# EAGLE design linearSensor (EAGLE 6.5.0)
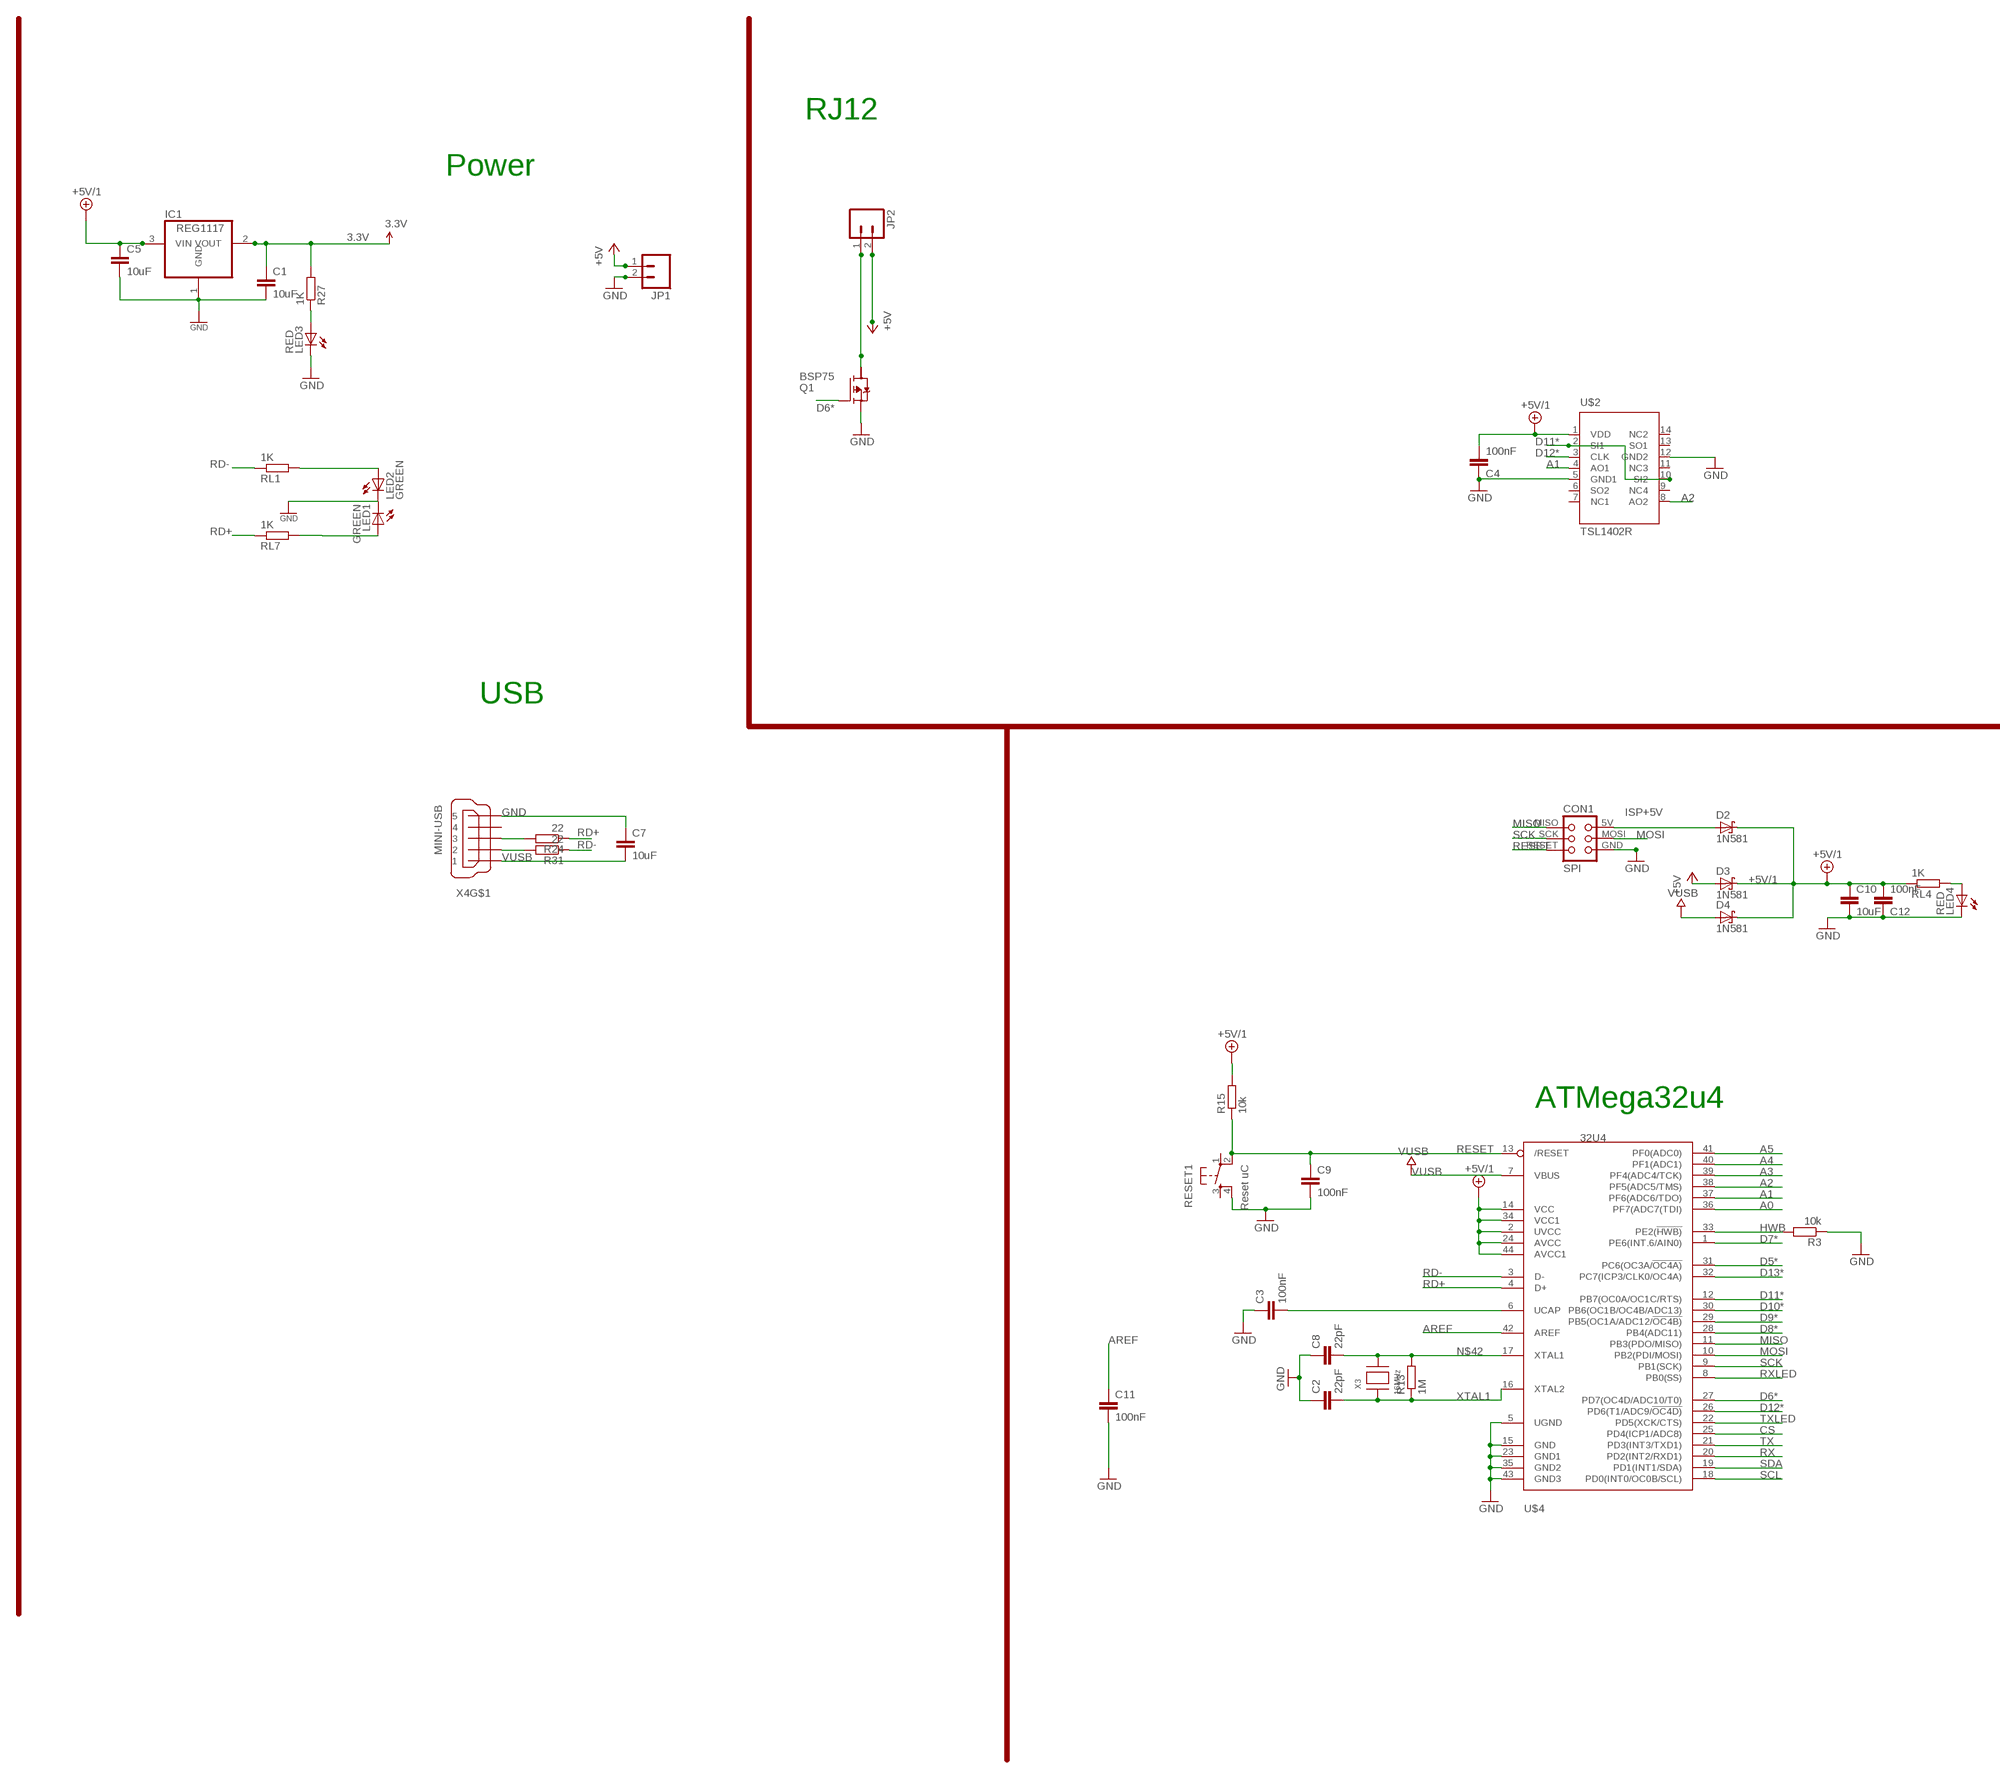
[diagram p0: schematic, sheet 1, part 1 of 2]
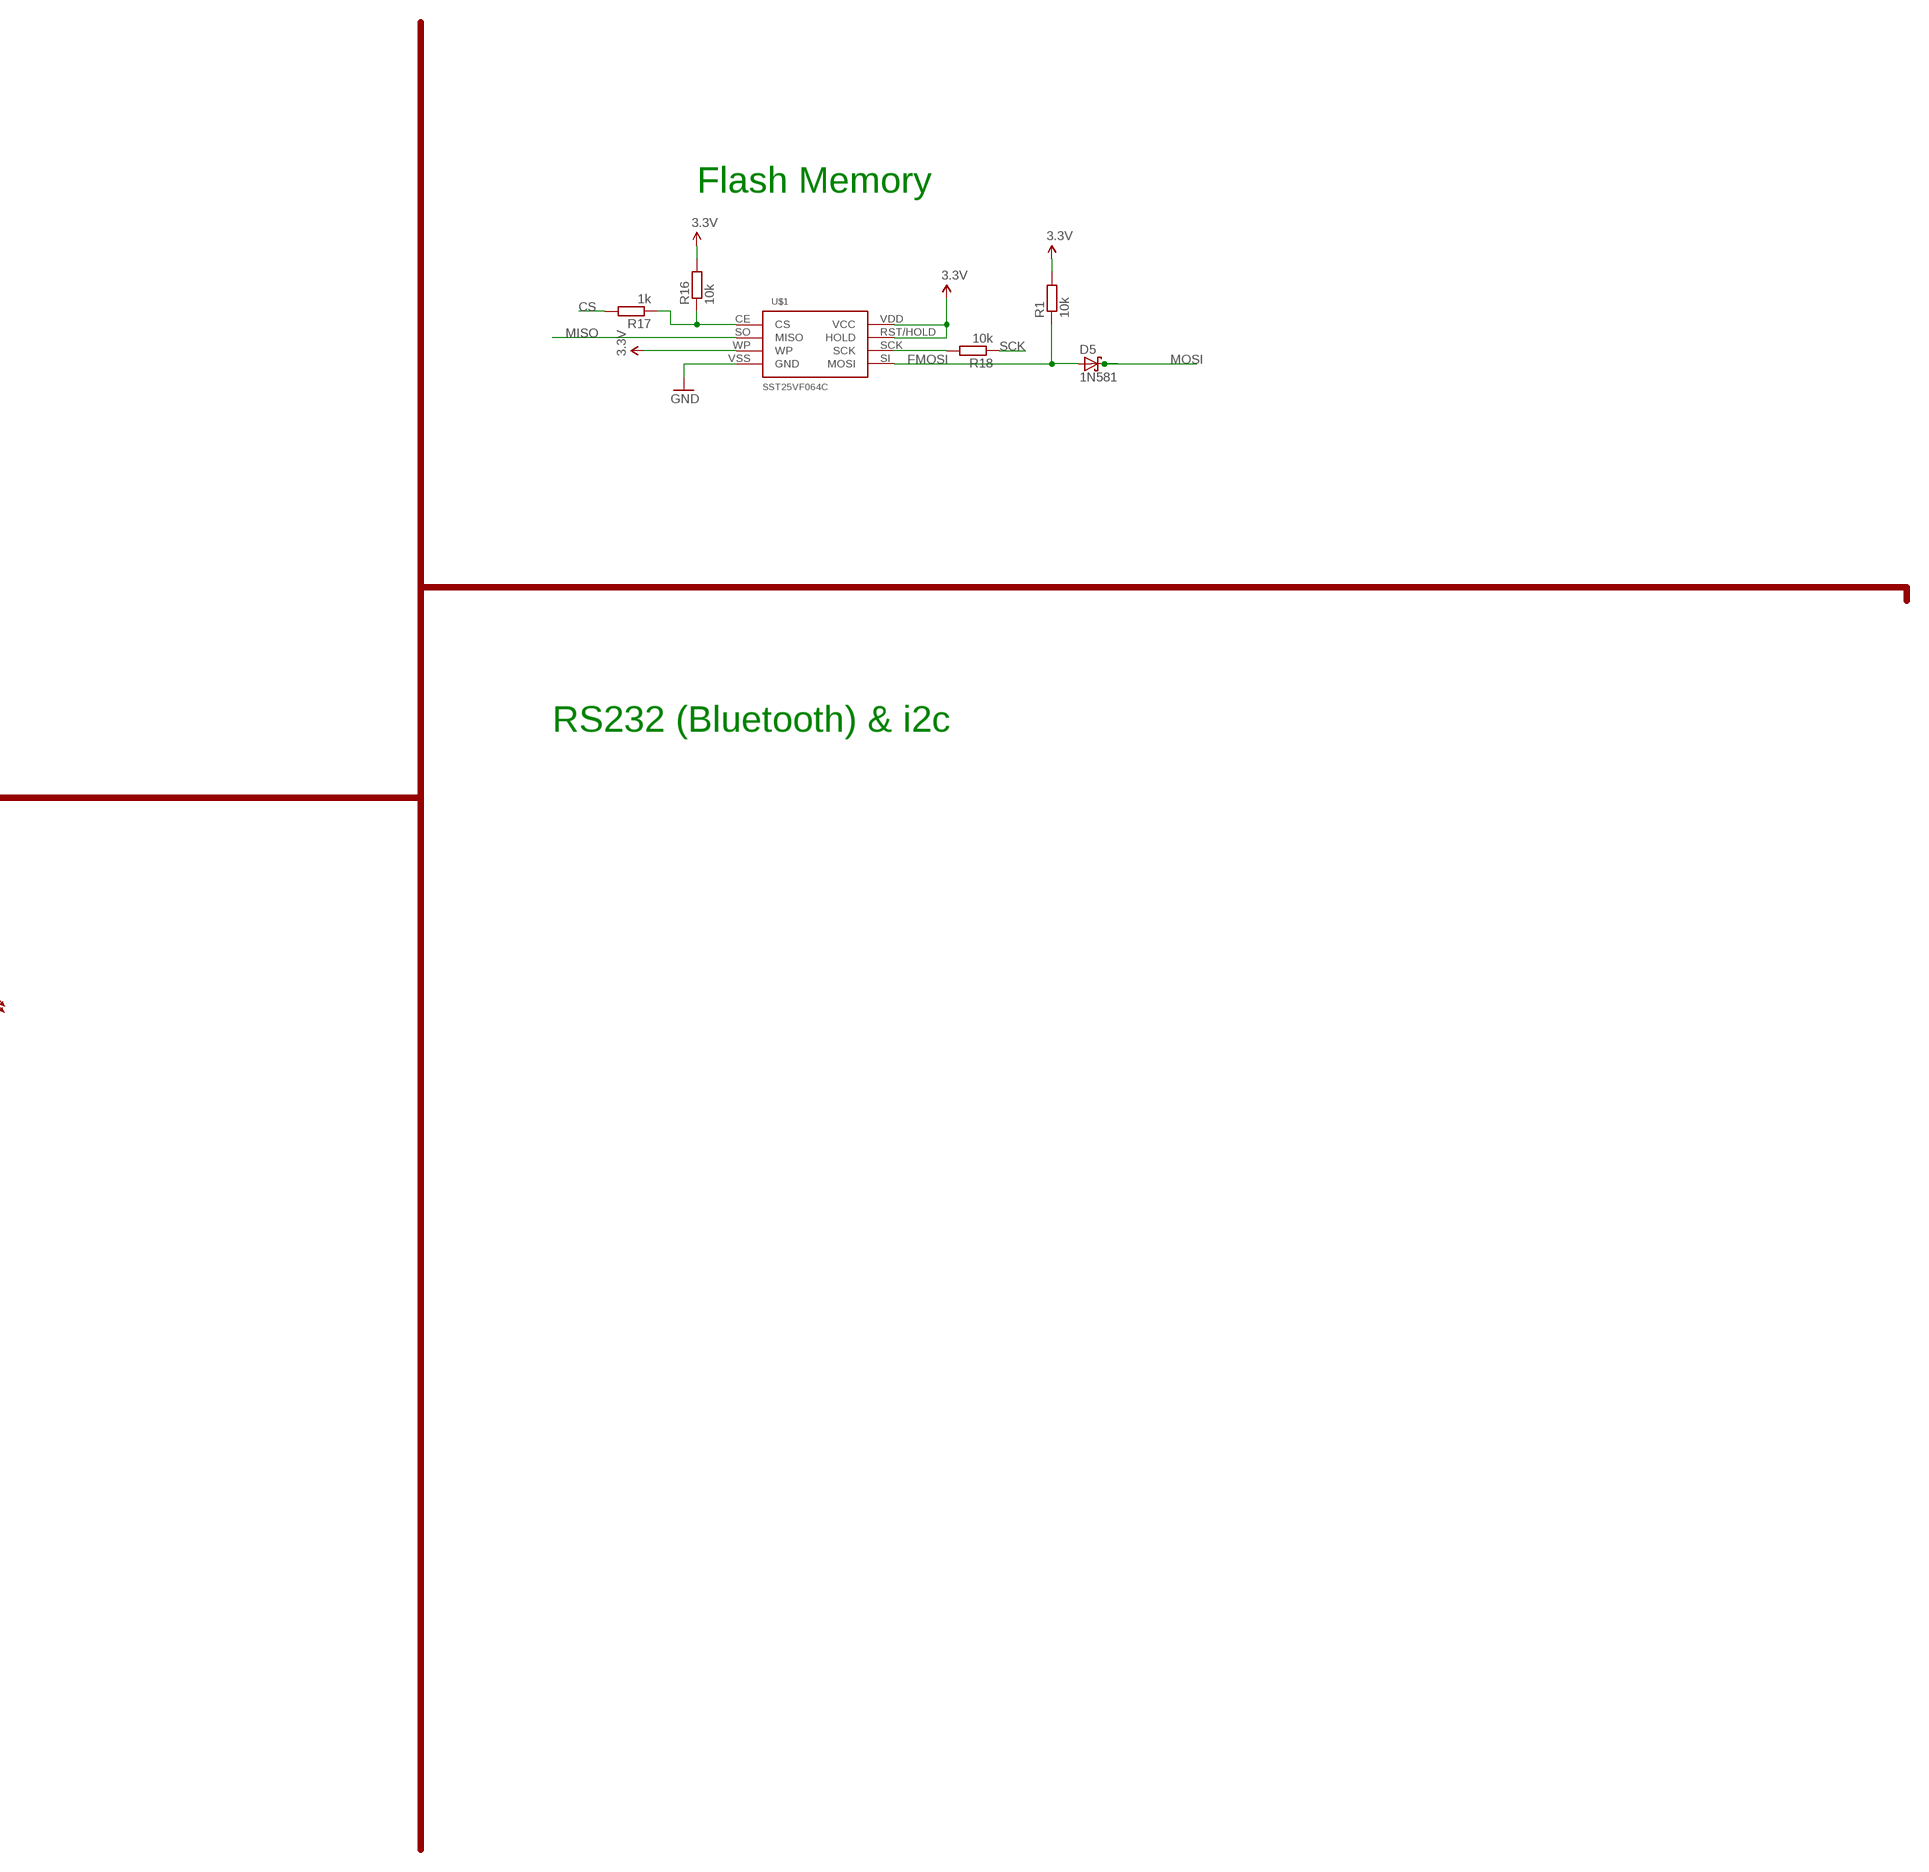
[diagram p1: schematic, sheet 1, part 2 of 2]

## Parts
C1  10uF  C-EUC1206  [C1206]
C2  22pF  C-EUC1206  [C1206]
C3  100nF  C-EUC1206  [C1206]
C4  100nF  C-EUC1206  [C1206]
C5  10uF  C-EUC1206  [C1206]
C7  10uF  C-EUC1206  [C1206]
C8  22pF  C-EUC1206  [C1206]
C9  100nF  C-EUC1206  [C1206]
C10  10uF  C-EUC1206  [C1206]
C11  100nF  C-EUC1206  [C1206]
C12  100nF  C-EUC1206  [C1206]
CON1  SPI  TINYISPT  [TC2030-MCP-NL]
D2  1N581  1N581D1206  [LED-1206]
D3  1N581  1N581D1206  [LED-1206]
D4  1N581  1N581D1206  [LED-1206]
D5  1N581  1N581D1206  [LED-1206]
IC1  REG1117  [SOT223]
JP1  M02LOCK_LONGPADS  [1X02_LOCK_LONGPADS]
JP2  M02LOCK_LONGPADS  [1X02_LOCK_LONGPADS]
LED1  GREEN  LEDCHIP-LED0805  [CHIP-LED0805]
LED2  GREEN  LEDCHIP-LED0805  [CHIP-LED0805]
LED3  RED  LEDCHIP-LED0805  [CHIP-LED0805]
LED4  RED  LEDCHIP-LED0805  [CHIP-LED0805]
Q1  BSP75  BSP613P  [PG-SOT-223]
R1  10k  R-EU_R1206  [R1206]
R3  10k  R-EU_M0805  [M0805]
R13  1M  R-EU_R1206  [R1206]
R15  10k  R-EU_M0805  [M0805]
R16  10k  R-EU_R1206  [R1206]
R17  1k  R-EU_R0805  [R0805]
R18  10k  R-EU_R1206  [R1206]
R24  22  R-EU_M1206  [M1206]
R27  1K  R-EU_R0805  [R0805]
R31  22  R-EU_M1206  [M1206]
RESET1  Reset uC  TAC_SWITCHSMD  [TACTILE_SWITCH_SMD]
RL1  1K  R-EU_R0805  [R0805]
RL4  1K  R-EU_R0805  [R0805]
RL7  1K  R-EU_R0805  [R0805]
U$1  SST25VF064C  [SOIC_8-LEAD]
U$2  TSL1402R  [DIL14]
U$4  32U4  ATMEGA32U4-AU  [TQFP44]
X3  16MHz  XTALNX6035  [NX6035]
X4  MINI-USB  MINI-USB-SCHIELD-32005-201  [32005-201]

## Nets
3.3V [power]: C1.1 IC1.2(VOUT) R1.2 R16.2 R27.2 U$1.RST/HOLD(HOLD) U$1.VDD(VCC) U$1.WP
+5V [power]: D3.A JP1.1 JP2.2
+5V/1 [fine]: C4.2 C5.1 C10.1 C12.2 D2.C D3.C D4.C IC1.3(VIN) R15.2 RL4.1 U$2.1(VDD) U$4.2(UVCC) U$4.14(VCC) U$4.24(AVCC) U$4.34(VCC1) U$4.44(AVCC1)
A0: U$4.36(PF7(ADC7(TDI))
A1: U$2.4(AO1) U$4.37(PF6(ADC6/TDO))
A2: U$2.8(AO2) U$4.38(PF5(ADC5/TMS))
A3: U$4.39(PF4(ADC4/TCK))
A4: U$4.40(PF1(ADC1))
A5: U$4.41(PF0(ADC0))
AREF: C11.1 U$4.42(AREF)
CS: R17.2 U$4.25(PD4(ICP1/ADC8))
D5*: U$4.31(PC6(OC3A/!OC4A))
D6*: Q1.1(G) U$4.27(PD7(OC4D/ADC10/T0))
D7*: U$4.1(PE6(INT.6/AIN0))
D8*: U$4.28(PB4(ADC11))
D9*: U$4.29(PB5(OC1A/ADC12/!OC4B))
D10*: U$4.30(PB6(OC1B/OC4B/ADC13))
D11*: U$2.2(SI1) U$2.10(SI2) U$4.12(PB7(OC0A/OC1C/RTS))
D12*: U$2.3(CLK) U$4.26(PD6(T1/ADC9/!OC4D))
D13*: U$4.32(PC7(ICP3/CLK0/OC4A))
D+USB: R24.2 X4.3
D-USB: R31.2 X4.2
FMOSI: D5.A R1.1 U$1.SI(MOSI)
GND [power]: C1.2 C2.1 C3.1 C4.1 C5.2 C7.1 C8.1 C9.2 C10.2 C11.2 C12.1 CON1.GND IC1.1(GND) JP1.2 LED1.C LED2.C LED3.C LED4.C Q1.3(S) R3.1 RESET1.4 U$1.VSS(GND) U$2.5(GND1) U$2.12(GND2) U$4.5(UGND) U$4.15(GND) U$4.23(GND1) U$4.35(GND2) U$4.43(GND3) X4.5
HWB: R3.2 U$4.33(PE2(!HWB))
ISP+5V: CON1.5V(VCC) D2.A
MISO: CON1.MISO U$1.SO(MISO) U$4.11(PB3(PDO/MISO))
MOSI: CON1.MOSI D5.C U$4.10(PB2(PDI/MOSI))
N$8: LED2.A RL1.2
N$10: R16.1 R17.1 U$1.CE(CS)
N$12: LED4.A RL4.2
N$14: LED1.A RL7.2
N$16: C3.2 U$4.6(UCAP)
N$20: LED3.A R27.1
N$23: R18.2 U$1.SCK
N$34: JP2.1 Q1.2(D)
N$42: C8.2 R13.2 U$4.17(XTAL1) X3.P$2
RD+: R24.1 RL7.1 U$4.4(D+)
RD-: R31.1 RL1.1 U$4.3(D-)
RESET: C9.1 CON1.RESET R15.1 RESET1.2 U$4.13(/RESET)
RX: U$4.20(PD2(INT2/RXD1))
RXLED: U$4.8(PB0(SS))
SCK: CON1.SCK R18.1 U$4.9(PB1(SCK))
SCL: U$4.18(PD0(INT0/OC0B/SCL))
SDA: U$4.19(PD1(INT1/SDA))
TX: U$4.21(PD3(INT3/TXD1))
TXLED: U$4.22(PD5(XCK/CTS))
VUSB: C7.2 D4.A U$4.7(VBUS) X4.1
XTAL1: C2.2 R13.1 U$4.16(XTAL2) X3.P$1
Unconnected: Q1.4(D) RESET1.1 RESET1.3 U$2.6(SO2) U$2.7(NC1) U$2.9(NC4) U$2.11(NC3) U$2.13(SO1) U$2.14(NC2) X4.4 X4.M1(S:S1) X4.M2(S:S2) X4.M3(S:S3) X4.M4(S:S4)

## Notes on the sheet
- RJ12
- Power
- Flash Memory
- RS232 (Bluetooth) & i2c
- USB
- ATMega32u4

## Library data of the parts
C1-C5 C7-C12 = rcl:C-EU: CAPACITOR, European symbol
CON1 = lpatiny:TINYISP: CONNECTOR
D2-D5 = lpatiny:1N581*: 1.0A SCHOTTKY BARRIER RECTIFIER Source: http://www.diodes.com/datasheets/ds23001.pdf
IC1 = burr-brown:REG1117: 800mA and 1A Low Dropout (LDO) Positive Regulator 1.8V, 2.5V, 2.85V, 3.3V, 5V, and Adj; MPN: REG1117; OC_FARNELL: 1097566; OC_NEWARK: 14P6981
JP1 JP2 = SparkFun:M02: Header 2 Standard 2-pin 0.1" header. Use with straight break away headers (SKU : PRT-00116), right angle break away headers (PRT-00553), swiss pins (PRT-00743), machine pins (PRT-00117), and female headers (PRT-00115). Molex polarized connector foot print use with SKU : PRT-08233 with associated crimp pins and housings.
LED1-LED4 = led:LED: LED OSRAM: - CHIPLED LG R971, LG N971, LY N971, LG Q971, LY Q971, LO R971, LY R971 LH N974, LH R974 LS Q976, LO Q976, LY Q976 LO Q996 - Hyper CHIPLED LW Q18S LB Q993, LB Q99A, LB R99A - SideLED LS A670, LO A670, LY A670, LG A670, LP A670 LB A673, LV A673, LT A673, LW A673 LH A674 LY A675 LS A676, LA A676, LO A676, LY A676, LW A676 LS A679, LY A679, LG A679 - Hyper Micro SIDELED® LS Y876, LA Y876, LO Y876, LY Y876 LT Y87S - SmartLED LW L88C, LW L88S LB L89C, LB L89S, LG L890 LS L89K, LO L89K, LY L89K LS L896, LA L896, LO L896, LY L896 - TOPLED LS T670, LO T670, LY T670, LG T670, LP T670 LSG T670, LSP T670, LSY T670, LOP T670, LYG T670 LG T671, LOG T671, LSG T671 LB T673, LV T673, LT T673, LW T673 LH T674 LS T676, LA T676, LO T676, LY T676, LB T676, LH T676, LSB T676, LW T676 LB T67C, LV T67C, LT T67C, LS T67K, LO T67K, LY T67K, LW E67C LS E67B, LA E67B, LO E67B, LY E67B, LB E67C, LV E67C, LT E67C LW T67C LS T679, LY T679, LG T679 LS T770, LO T770, LY T770, LG T770, LP T770 LB T773, LV T773, LT T773, LW T773 LH T774 LS E675, LA E675, LY E675, LS T675 LS T776, LA T776, LO T776, LY T776, LB T776 LHGB T686 LT T68C, LB T68C - Hyper Mini TOPLED® LB M676 - Mini TOPLED Santana® LG M470 LS M47K, LO M47K, LY M47K Source: http://www.osram.convergy.de LUXEON: - LUMILED® LXK2-PW12-R00, LXK2-PW12-S00, LXK2-PW14-U00, LXK2-PW14-V00 LXK2-PM12-R00, LXK2-PM12-S00, LXK2-PM14-U00 LXK2-PE12-Q00, LXK2-PE12-R00, LXK2-PE12-S00, LXK2-PE14-T00, LXK2-PE14-U00 LXK2-PB12-K00, LXK2-PB12-L00, LXK2-PB12-M00, LXK2-PB14-N00, LXK2-PB14-P00, LXK2-PB14-Q00 LXK2-PR12-L00, LXK2-PR12-M00, LXK2-PR14-Q00, LXK2-PR14-R00 LXK2-PD12-Q00, LXK2-PD12-R00, LXK2-PD12-S00 LXK2-PH12-R00, LXK2-PH12-S00 LXK2-PL12-P00, LXK2-PL12-Q00, LXK2-PL12-R00 Source: www.luxeon.com KINGBRIGHT: KA-3528ASYC Source: www.kingbright.com
Q1 = infineon:BSP613P: SIPMOS (R) Small-Signal-Transistor P-Channel (2 Drain) Source: http://www.infineon.com/dgdl/BSP613P_Rev2.4.pdf; OC_FARNELL: unknown; OC_NEWARK: unknown
R1 R13 R16-R18 R27 RL1 RL7 = rcl:R-EU_: RESISTOR, European symbol
R3 R15 R24 R31 RL4 = resistor:R-EU_: RESISTOR, European symbol
RESET1 = lpatiny:TAC_SWITCH: Momentary Switch Button commonly used for reset or general input. Spark Fun Electronics SKU : COM-00097
U$1 = BertaLib:SST25VF064C
U$2 = lpatiny:TSL1402R
U$4 = adafruit:ATMEGA32U4: http://www.ladyada.net/library/eagle
X3 = lpatiny:XTAL: Low cost SMT crystals, no capacitors included http://www.ladyada.net/library/eagle
X4 = con-cypressindustries:MINI-USB-SCHIELD-: MINI USB-B Conector Source: www.cypressindustries.com; OC_FARNELL: unknown; OC_NEWARK: unknown

## Net classes
0 default: width 0.305 mm
1 power: width 0.457 mm
2 VIN: width 0.457 mm
3 fine: width 0.305 mm
4 aref: width 0.305 mm

## Board
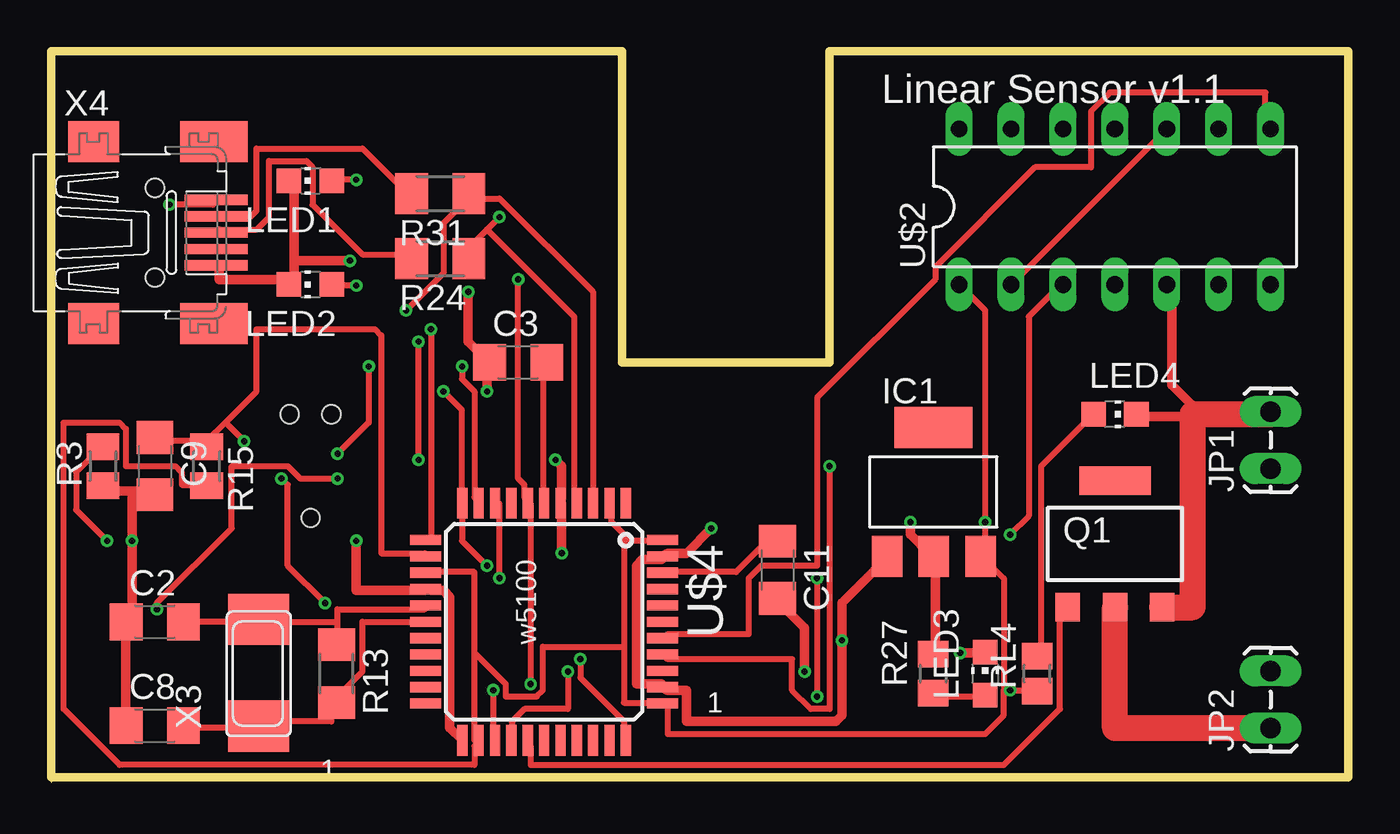
[diagram p2: board, top side]
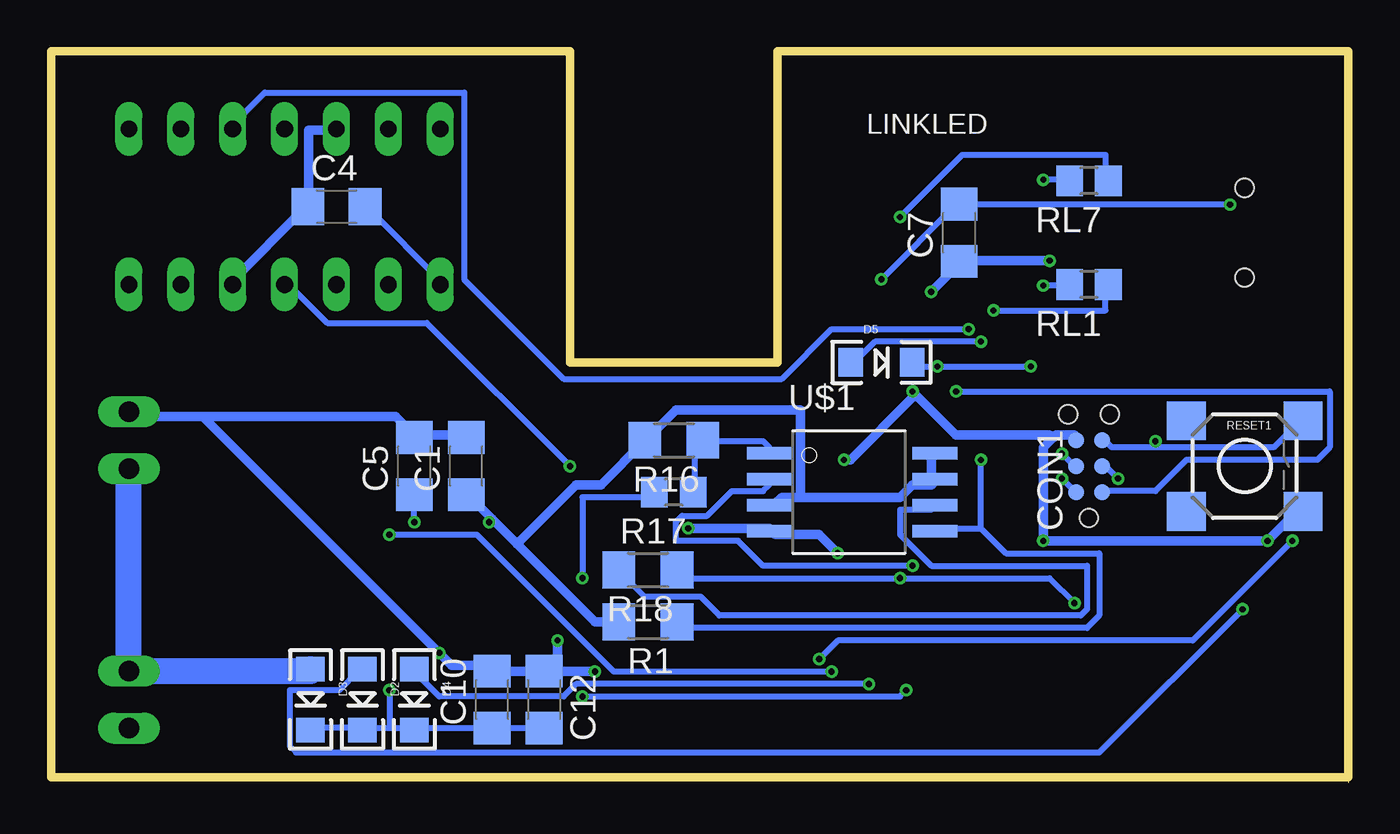
[diagram p3: board, bottom side, seen from below]

Size 63.5 x 35.81 mm. Coordinates in mm from the lower left corner, seen from the top.
Outline: 0,35.81 0,0.25
Outline: 0,0.25 0,0
Outline: 0,35.81 27.94,35.81 27.94,20.57 38.1,20.57 38.1,35.81 63.5,35.81 63.5,0.25 0,0.25
Outline: 0,35.81 0,0.25
Copper layers (1*16): Top 0.035mm / dielectric 1.5mm / Bottom 0.035mm
Design rules "Fusion_eagle_rule_v1.1": minimum track width 6mil, minimum drill 12mil, track to track 6mil, track to pad 6mil, pad to pad 6mil, via to via 6mil, smd to smd 0mil, copper to edge 10mil, drill to drill 10mil, minimum pad ring 10mil, minimum via ring 6mil, stop-mask expansion 2mil, vias tented up to drill 100mil, thermal gap 10mil
vRestrict: area 16.5,0.3 to 31.8,4.1; area 16.5,1.5 to 20.3,15.5; area 27.9,2.8 to 31.8,15.5; area 16.5,11.7 to 31.8,15.5

### Footprints (pad centres in the part's own frame; a part is rotated, then mirrored left to right if it is on the bottom)
C1206 = smd 1.6 x 1.8: 1 -1.4,0; 2 1.4,0
TC2030-MCP-NL = smd 0.787 x 0.787: 5V 1.27,0.635; GND 3.81,0.635; MISO 1.27,-0.635; MOSI 2.54,0.635; RESET 3.81,-0.635; SCK 2.54,-0.635 | hole 0.889: 0,0; 5.08,-1.016; 5.08,1.016
LED-1206 = smd 1.2 x 1.4: A -1.5,0; C 1.5,0
SOT223 = smd 1.499 x 2.007: 1 -2.261,-3.15; 2 0.025,-3.15; 3 2.311,-3.15 | smd 3.81 x 2.007: 4 0,3.15
1X02_LOCK_LONGPADS = drill 1.016 long: 1 -0.127,0; 2 2.667,0
CHIP-LED0805 = smd 1.2 x 1.2: A 0,-1.05; C 0,1.05
PG-SOT-223 = smd 1.2 x 1.4: 1 -2.311,-3.099; 2 0,-3.099; 3 2.311,-3.099 | smd 3.5 x 1.4: 4 0,3.099
R1206 = smd 1.6 x 1.803: 1 -1.422,0; 2 1.422,0
M0805 = smd 1.3 x 1.6: 1 -0.95,0; 2 0.95,0
R0805 = smd 1.3 x 1.5: 1 -0.95,0; 2 0.95,0
M1206 = smd 1.6 x 2: 1 -1.4,0; 2 1.4,0
TACTILE_SWITCH_SMD = smd 1.905 x 1.905: 1 -2.857,2.223; 2 2.857,2.223; 3 -2.857,-2.223; 4 2.857,-2.223
R0805' = smd 1.3 x 1.5: 1 -0.85,0; 2 0.85,0
SOIC_8-LEAD = smd 0.61 x 2.21: CE -1.905,-2.934; RST/HOLD -0.635,5.156; SCK 0.635,5.156; SI 1.905,5.156; SO -0.635,-2.934; VDD -1.905,5.156; VSS 1.905,-2.934; WP 0.635,-2.934
DIL14 = drill 0.813 long: 1 -7.62,-3.81; 2 -5.08,-3.81; 3 -2.54,-3.81; 4 0,-3.81; 5 2.54,-3.81; 6 5.08,-3.81; 7 7.62,-3.81; 8 7.62,3.81; 9 5.08,3.81; 10 2.54,3.81; 11 0,3.81; 12 -2.54,3.81; 13 -5.08,3.81; 14 -7.62,3.81
TQFP44 = smd 1.5 x 0.5: 1 -5.8,4; 2 -5.8,3.2; 3 -5.8,2.4; 4 -5.8,1.6; 5 -5.8,0.8; 6 -5.8,0; 7 -5.8,-0.8; 8 -5.8,-1.6; 9 -5.8,-2.4; 10 -5.8,-3.2; 11 -5.8,-4; 23 5.8,-4; 24 5.8,-3.2; 25 5.8,-2.4; 26 5.8,-1.6; 27 5.8,-0.8; 28 5.8,0; 29 5.8,0.8; 30 5.8,1.6; 31 5.8,2.4; 32 5.8,3.2; 33 5.8,4 | smd 0.5 x 1.5: 12 -4,-5.8; 13 -3.2,-5.8; 14 -2.4,-5.8; 15 -1.6,-5.8; 16 -0.8,-5.8; 17 0,-5.8; 18 0.8,-5.8; 19 1.6,-5.8; 20 2.4,-5.8; 21 3.2,-5.8; 22 4,-5.8; 34 4,5.8; 35 3.2,5.8; 36 2.4,5.8; 37 1.6,5.8; 38 0.8,5.8; 39 0,5.8; 40 -0.8,5.8; 41 -1.6,5.8; 42 -2.4,5.8; 43 -3.2,5.8; 44 -4,5.8
NX6035 = smd 2.5 x 3: P$1 2.665,0; P$2 -2.565,0
32005-201 = smd 3.1 x 0.5: 1 3,1.6; 2 3,0.8; 3 3,0; 4 3,-0.8; 5 3,-1.6 | smd 2.5 x 2: M1 -3,-4.45; M2 -3,4.45 | smd 3.3 x 2: M3 2.9,4.45; M4 2.9,-4.45 | hole 0.9: 0,2.2; 0,-2.2

### Placement (x,y rotation side)
C1  43.18,15.49 90 bottom
C2  5.08,7.87 0 top
C3  22.86,20.57 0 top
C4  49.53,28.19 0 bottom
C5  45.72,15.49 90 bottom
C7  19.05,26.92 90 bottom
C8  5.08,2.79 0 top
C9  5.08,15.49 270 top
C10  41.91,4.06 90 bottom
C11  35.56,10.41 270 top
C12  39.37,4.06 270 bottom
CON1  12.7,12.95 90 bottom
D2  48.26,4.06 270 bottom
D3  50.8,4.06 270 bottom
D4  45.72,4.06 270 bottom
D5  22.86,20.57 0 bottom
IC1  43.18,14.22 0 top
JP1  59.69,15.49 90 top
JP2  59.69,2.79 90 top
LED1  12.7,29.46 90 top
LED2  12.7,24.38 90 top
LED3  45.72,5.33 0 top
LED4  52.07,18.03 270 top
Q1  52.07,11.68 0 top
R1  34.29,7.87 180 bottom
R3  2.54,15.49 90 top
R13  13.97,5.33 270 top
R15  7.62,15.49 270 top
R16  33.02,16.76 180 bottom
R17  33.02,14.22 180 bottom
R18  34.29,10.41 180 bottom
R24  19.05,25.65 180 top
R27  43.18,5.33 90 top
R31  19.05,28.83 180 top
RESET1  5.08,15.49 0 bottom
RL1  12.7,24.38 180 bottom
RL4  1K  [R0805']  48.26,5.33 90 top
RL7  12.7,29.46 180 bottom
U$1  25.4,14.22 270 bottom
U$2  52.07,28.19 0 top
U$4  24.13,7.87 270 top
X3  10.16,5.33 90 top
X4  5.08,26.92 0 top

### Tracks (layer width: path | path; a pad name or v marks a point on that pad's centre or on a via)
3.3V  (via drill 0.3)
  Top 0.457: R27.2 43.28,6.35 43.28,10.92 IC1.2 42.98,11.23 42.06,12.14 v42.06,12.75
  Bottom 0.457: U$1.VDD 20.42,16.1 20.42,14.88 U$1.RST/HOLD 20.42,14.58 21.34,14.58 21.95,13.97 26.82,13.97 | 26.82,13.97 27.74,13.97 28.04,13.66 U$1.WP | 40.69,11.68 36.88,7.87 35.97,7.87 R1.2 | 40.69,11.68 41.91,12.9 | 41.91,12.9 42.98,13.97 C1.1 | 40.69,11.68 40.54,11.84 37.8,14.58 36.58,14.58 34.44,16.71 R16.2 34.14,17.02 32.92,18.24 26.82,18.24 26.82,13.97 | v42.06,12.75 41.91,12.9
+5V
  Bottom 1.27: JP1.1 JP2.2 50.8,5.46 D3.A
+5V/1  (via drill 0.3)
  Top 0.305: 46.63,4.52 v46.94,4.52 48.16,4.52 RL4.1 | 46.63,4.52 46.63,10.01 45.72,10.92 IC1.3 45.72,11.23 v45.72,12.75 45.72,23.11 44.5,24.33 U$2.1 | 28.04,12.14 28.35,11.84 29.87,11.84 U$4.44 | 28.04,12.14 27.43,12.75 27.43,13.66 U$4.2 | 28.04,12.14 28.04,6.65 | 28.04,6.65 28.04,3.91 29.87,3.91 U$4.34 30.18,3.91 30.18,2.39 45.72,2.39 46.63,3.3 46.63,4.52 | 20.73,6.35 20.73,2.08 U$4.24 20.73,1.78 20.73,0.86 3.35,0.86 0.61,3.61 0.61,17.63 3.35,17.63 3.66,17.32 3.66,15.49 6.1,15.49 6.4,15.19 6.4,14.58 7.62,14.58 R15.2 | 20.73,6.35 20.73,10.31 18.59,10.31 U$4.14 | 28.04,6.65 24.08,6.65 24.08,4.52 23.77,4.22 22.25,4.22 22.25,4.83 20.73,6.35
  Bottom 0.305: C12.2 39.62,2.69 41.76,2.69 C10.1 42.06,2.69 45.72,2.69 | 46.94,2.69 48.16,2.69 D2.C 48.46,2.69 50.6,2.69 D3.C | 46.94,2.69 45.72,2.69 | 45.72,2.69 D4.C 45.72,2.69 | C4.2 47.85,27.99 44.5,24.64 U$2.1 | v45.72,12.75 45.72,13.97 C5.1 | v46.94,4.52 46.94,2.69
A1  (via drill 0.3)
  Top 0.305: v38.1,15.49 38.1,3.61 37.19,3.61 36.27,4.52 36.27,6.04 30.18,6.04 U$4.37
  Bottom 0.305: v38.1,15.49 45.11,22.5 49.99,22.5 51.82,24.33 U$2.4
A2
  Top 0.305: U$4.38 30.18,7.26 34.14,7.26 34.14,10.01 34.75,10.62 37.49,10.62 37.49,18.85 43.28,24.64 43.28,25.25 48.16,30.12 50.9,30.12 50.9,32.87 51.82,33.78 59.44,33.78 59.44,32.26 U$2.8
AREF
  Top 0.305: U$4.42 30.18,10.31 33.53,10.31 34.75,11.53 35.36,11.53 C11.1
CS  (via drill 0.3)
  Top 0.305: v21.64,4.52 21.64,2.08 U$4.25 | v37.49,10.01 v37.49,4.22
  Bottom 0.305: v21.64,4.52 21.95,4.22 v37.49,4.22 | v37.49,10.01 37.49,13.97 34.14,13.97 R17.2
D6*
  Top 0.305: Q1.1 49.68,8.48 49.38,8.18 49.38,3.61 46.63,0.86 23.47,0.86 23.47,1.78 U$4.27
D11*  (via drill 0.3)
  Top 0.305: v18.59,22.2 18.59,11.84 U$4.12 | U$2.2 47.24,24.64 54.56,31.95 U$2.10
  Bottom 0.305: v18.59,22.2 25.3,22.2 27.74,19.76 38.41,19.76 43.28,24.64 43.28,33.78 53.03,33.78 54.56,32.26 U$2.10
D12*  (via drill 0.3)
  Top 0.305: v25.3,5.44 25.3,3.61 23.16,3.61 22.55,3 22.55,2.08 U$4.26 | v46.94,12.14 47.85,13.06 47.85,22.81 49.38,24.33 U$2.3
  Bottom 0.305: v25.3,5.44 35.97,5.44 42.67,12.14 v46.94,12.14
D+USB
  Top 0.305: R24.2 17.37,25.86 15.24,25.86 12.8,28.3 12.8,30.12 12.5,30.43 10.67,30.43 10.67,27.69 10.06,27.08 8.23,27.08 X4.3
D-USB
  Top 0.305: R31.2 17.37,28.91 15.24,31.04 10.06,31.04 10.06,27.99 9.75,27.69 8.23,27.69 X4.2
FMOSI  (via drill 0.3)
  Top 0.305: v17.98,15.8 v17.98,21.59
  Bottom 0.305: v17.98,21.59 23.16,21.59 24.08,20.68 D5.A | 17.98,12.45 v17.98,15.8 | 17.98,12.45 20.12,12.45 U$1.SI | 17.98,12.45 16.76,11.23 12.19,11.23 12.19,8.18 12.8,7.57 32.31,7.57 32.61,7.87 R1.1
GND  (via drill 0.3)
  Top 0.457: v20.42,24.03 20.42,21.59 21.34,20.68 C3.1 21.34,20.37 v21.34,19.15 | X4.5 8.23,25.25 8.23,24.64 11.58,24.64 LED2.C 11.89,24.64 11.89,25.55 | 11.89,25.55 11.89,29.21 LED1.C | 11.89,25.55 v14.63,25.55 | 3.96,14.28 4.88,14.28 C9.2 | 3.96,14.28 2.74,14.28 R3.1 | C8.1 3.66,3 3.66,7.87 C2.1 3.96,7.87 v3.96,11.84 3.96,14.28 | U$4.23 20.12,2.08 19.51,2.69 19.51,9.09 19.2,9.4 18.59,9.4 U$4.15 18.29,9.4 14.94,9.4 v14.94,11.84 | v24.99,11.23 24.99,13.66 U$4.5 24.99,13.97 24.99,15.49 v24.69,15.8 | IC1.1 40.84,11.23 IC1.1 | IC1.1 40.84,10.92 38.71,8.79 v38.71,6.96 38.71,3.3 38.41,3 31.09,3 31.09,4.52 30.18,4.52 U$4.35 29.87,4.83 28.65,4.83 28.65,10.62 28.96,10.92 29.87,10.92 U$4.43 30.18,11.23 31.09,11.23 v32.31,12.45 | v44.5,6.35 45.72,6.35 LED3.C | v36.88,5.44 36.88,7.57 35.66,8.79 C11.2 | LED4.C 53.34,17.93 55.47,17.93 55.88,17.93 | 55.88,18.03 55.78,18.54 54.86,19.46 54.86,24.33 U$2.5
  Top 1.27: Q1.3 55.88,8.58 55.88,17.93 55.88,18.03 59.69,18.03 JP1.2
  Bottom 0.457: v20.42,24.03 19.2,25.25 C7.1 18.9,25.55 v14.63,25.55 | 14.48,16.87 14.94,16.41 v14.94,11.84 v3.96,11.84 2.74,13.06 2.44,13.06 RESET1.4 | 14.48,16.87 14.33,17.02 13.41,17.02 CON1.GND | 21.18,19 19.2,17.02 14.63,17.02 14.48,16.87 | 21.18,19 v21.34,19.15 | v24.99,11.23 25.91,12.14 28.04,12.14 U$1.VSS 28.35,12.45 v32.31,12.45 | C12.1 39.62,5.44 41.76,5.44 C10.2 42.06,5.74 43.89,5.74 v44.5,6.35 56.08,17.93 | 38.71,5.44 39.32,5.44 C12.1 | 38.71,5.44 v36.88,5.44 | U$2.12 49.68,31.95 50.9,31.95 50.9,28.3 C4.1 51.21,27.99 54.56,24.64 U$2.5 | 45.72,17.02 43.28,17.02 C1.2 | 45.72,17.02 C5.2 45.72,17.02 | 45.72,17.02 46.63,17.93 56.08,17.93 | 56.08,17.93 59.44,17.93 JP1.2 | 38.71,5.44 v38.71,6.96 | 38.71,5.44 C12.1 | v24.69,15.8 24.38,15.8 21.34,18.85 21.18,19
HWB  (via drill 0.3)
  Top 0.305: v25.91,6.04 25.91,5.13 28.04,3 28.04,2.08 U$4.33 | v2.74,11.84 1.22,13.36 1.22,15.19 2.44,16.41 R3.2
  Bottom 0.305: v25.91,6.04 24.99,6.96 7.62,6.96 v2.74,11.84
ISP+5V  (via drill 0.3)
  Top 0.305: v14.02,14.88 12.19,14.88 11.58,15.49 8.84,15.49 8.84,12.45 5.18,8.79 v5.18,8.48
  Bottom 0.305: v14.02,14.88 13.41,14.28 CON1.5V | v5.18,8.48 12.19,1.47 51.51,1.47 51.82,1.78 51.82,4.52 49.38,4.52 48.46,5.44 D2.A
MISO  (via drill 0.3)
  Top 0.305: v19.2,19.15 20.12,18.24 20.12,13.97 U$4.11 20.12,13.66 20.12,11.84 v21.34,10.62
  Bottom 0.305: v19.2,19.15 0.91,19.15 0.91,16.41 1.52,15.8 7.92,15.8 9.45,14.28 11.89,14.28 CON1.MISO | v21.34,10.62 28.65,10.62 29.87,11.84 32.92,11.84 32.92,12.75 32.61,13.06 31.39,13.06 30.18,14.28 28.65,14.28 28.35,14.58 U$1.SO
MOSI  (via drill 0.3)
  Top 0.305: v14.02,16.1 15.54,17.63 v15.54,20.37 | v20.12,20.37 20.12,19.76 20.73,19.15 20.73,13.97 U$4.10
  Bottom 0.305: v14.02,16.1 13.41,15.49 CON1.MOSI | v15.54,20.37 v20.12,20.37 21.34,20.37 D5.C
N$8  (via drill 0.3)
  Top 0.305: v14.94,24.33 14.02,24.33 LED2.A
  Bottom 0.305: v14.94,24.33 13.72,24.33 RL1.2
N$10
  Bottom 0.305: R17.1 32,14.28 32,16.71 31.7,16.71 R16.1 31.39,16.71 28.65,16.71 28.35,16.41 U$1.CE
N$12
  Top 0.305: LED4.A 50.9,17.93 48.46,15.49 48.46,6.35 RL4.2
N$14  (via drill 0.3)
  Top 0.305: v14.94,29.52 14.02,29.52 LED1.A
  Bottom 0.305: v14.94,29.52 13.72,29.52 RL7.2
N$16
  Top 0.305: U$4.6 24.08,13.97 24.08,20.37 C3.2
N$20
  Top 0.305: LED3.A 45.72,4.22 43.28,4.22 R27.1
N$23
  Bottom 0.305: R18.2 35.66,10.31 34.44,9.09 31.7,9.09 30.79,8.18 13.11,8.18 12.8,8.48 12.8,10.62 20.42,10.62 21.95,12.14 21.95,13.36 20.42,13.36 U$1.SCK
N$34
  Top 1.27: JP2.1 52.07,2.67 Q1.2
N$42
  Top 0.305: C8.2 6.71,2.69 10.06,2.69 X3.P$2 10.36,3 13.72,3 13.72,3.91 R13.2 14.02,4.22 15.24,5.44 15.24,7.87 18.29,7.87 U$4.17
RD+  (via drill 0.3)
  Top 0.305: 21.34,27.08 20.73,26.47 20.73,25.86 R24.1 | 21.34,27.08 v21.95,27.69 | 21.34,27.08 25.6,22.81 25.6,13.97 U$4.4
  Bottom 0.305: v21.95,27.69 18.9,30.73 11.89,30.73 11.89,29.52 RL7.1
RD-  (via drill 0.3)
  Top 0.305: v17.37,23.11 19.2,24.94 19.2,27.38 20.42,28.6 R31.1 20.73,28.6 21.95,28.6 26.52,24.03 26.52,13.97 U$4.3
  Bottom 0.305: v17.37,23.11 11.89,23.11 11.89,24.33 RL1.1
RESET  (via drill 0.3)
  Top 0.305: 7.62,16.71 8.53,17.63 | 8.53,17.63 10.06,19.15 10.06,22.2 15.85,22.2 16.15,21.89 16.15,11.23 18.29,11.23 U$4.13 | 7.62,16.71 R15.1 7.62,16.71 | 7.62,16.71 5.18,16.71 C9.1 | 8.53,17.63 v9.45,16.71
  Bottom 0.305: 9.45,16.41 3.66,16.41 2.44,17.63 RESET1.2 | 9.45,16.41 11.58,16.41 11.89,16.71 CON1.RESET | v9.45,16.71 9.45,16.41
SCK  (via drill 0.3)
  Top 0.305: v11.28,14.88 11.58,14.58 11.58,10.62 v13.41,8.79 | v21.95,10.01 21.95,13.66 U$4.9
  Bottom 0.305: v11.28,14.88 11.89,15.49 CON1.SCK | v13.41,8.79 14.63,10.01 v21.95,10.01 32.31,10.01 32.61,10.31 R18.1
VUSB  (via drill 0.3)
  Top 0.305: v5.79,28.3 7.92,28.3 X4.1 | v23.47,4.83 23.47,13.66 U$4.7 23.16,13.97 23.16,14.58 22.86,14.88 v22.86,24.64
  Bottom 0.305: v5.79,28.3 18.9,28.3 C7.2 19.2,28.3 v22.86,24.64 | v23.47,4.83 37.8,4.83 38.41,4.22 44.5,4.22 45.72,5.44 D4.A
XTAL1
  Top 0.305: 14.02,7.87 14.02,6.96 R13.1 | 14.02,7.87 14.02,8.48 18.29,8.48 U$4.16 | C2.2 6.71,7.87 10.06,7.87 X3.P$1 10.36,7.87 14.02,7.87

### Text on the board
tPlace: Linear Sensor v1.1
tNames: w5100 | 1 | 1
bNames: LINKLED
203bmp: C:/Users/G/Pictures/logo_epfl.bmp